# Altium project imx8m-devmodule.PrjPcb
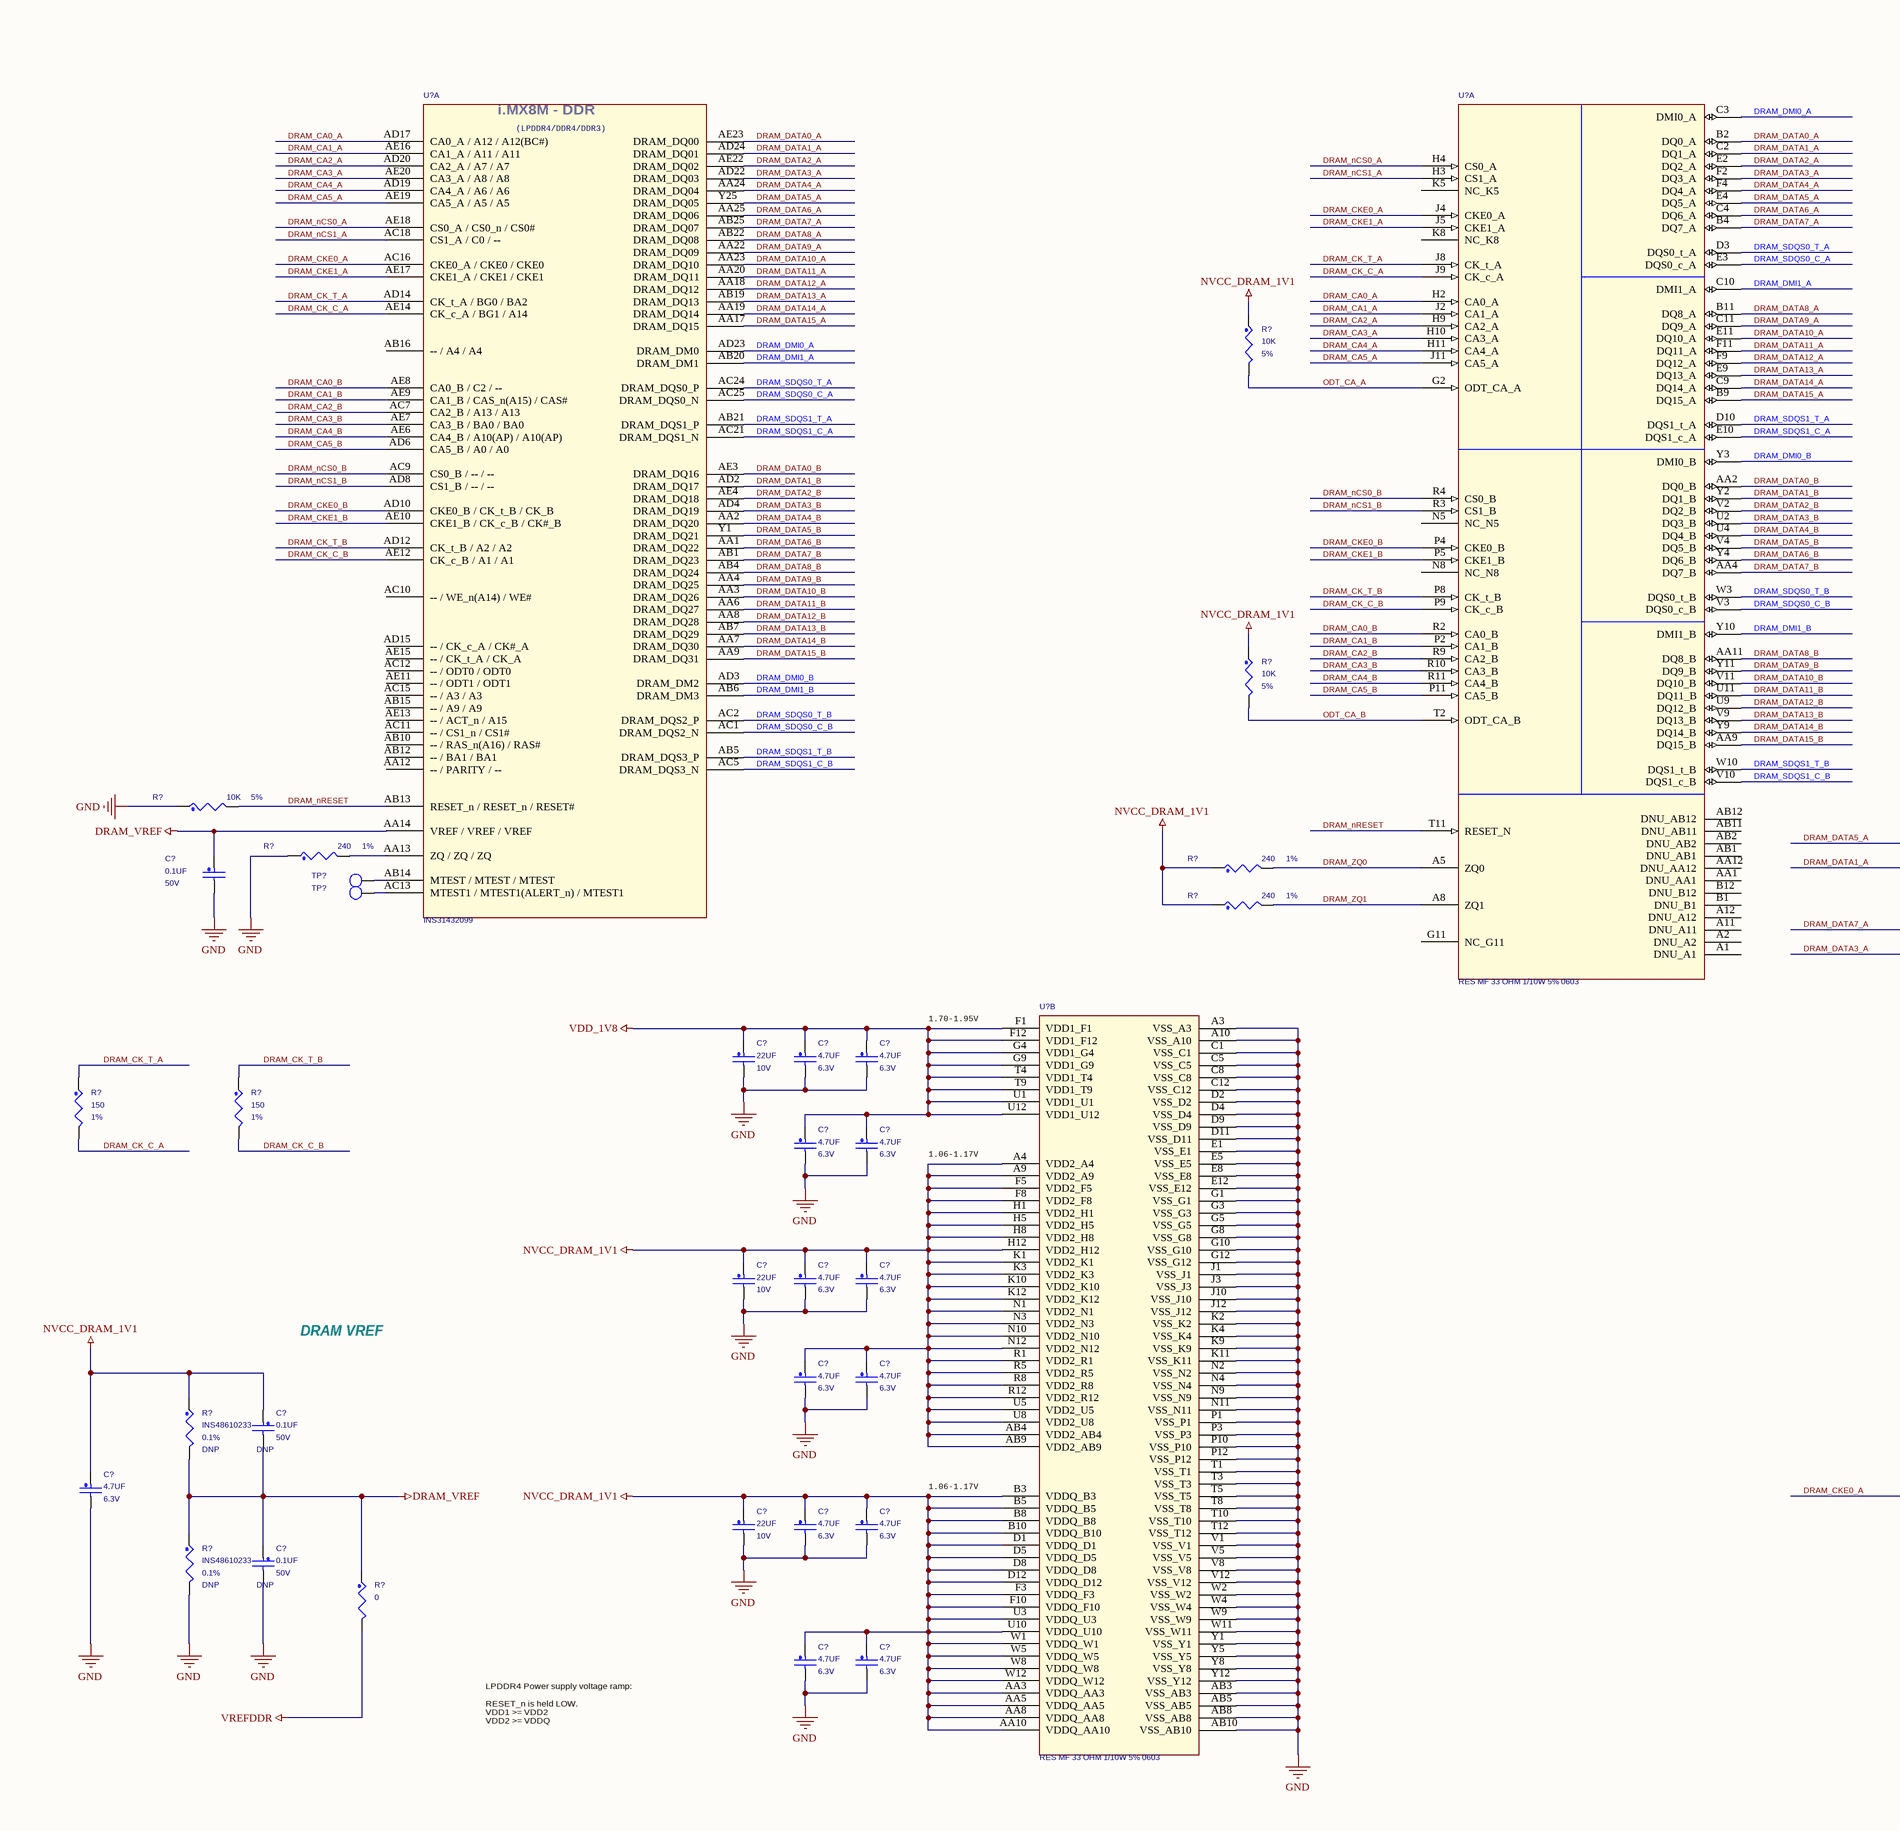
[diagram p0: C-05.1 DDR4 SO-DIMM 260.SchDoc, left]
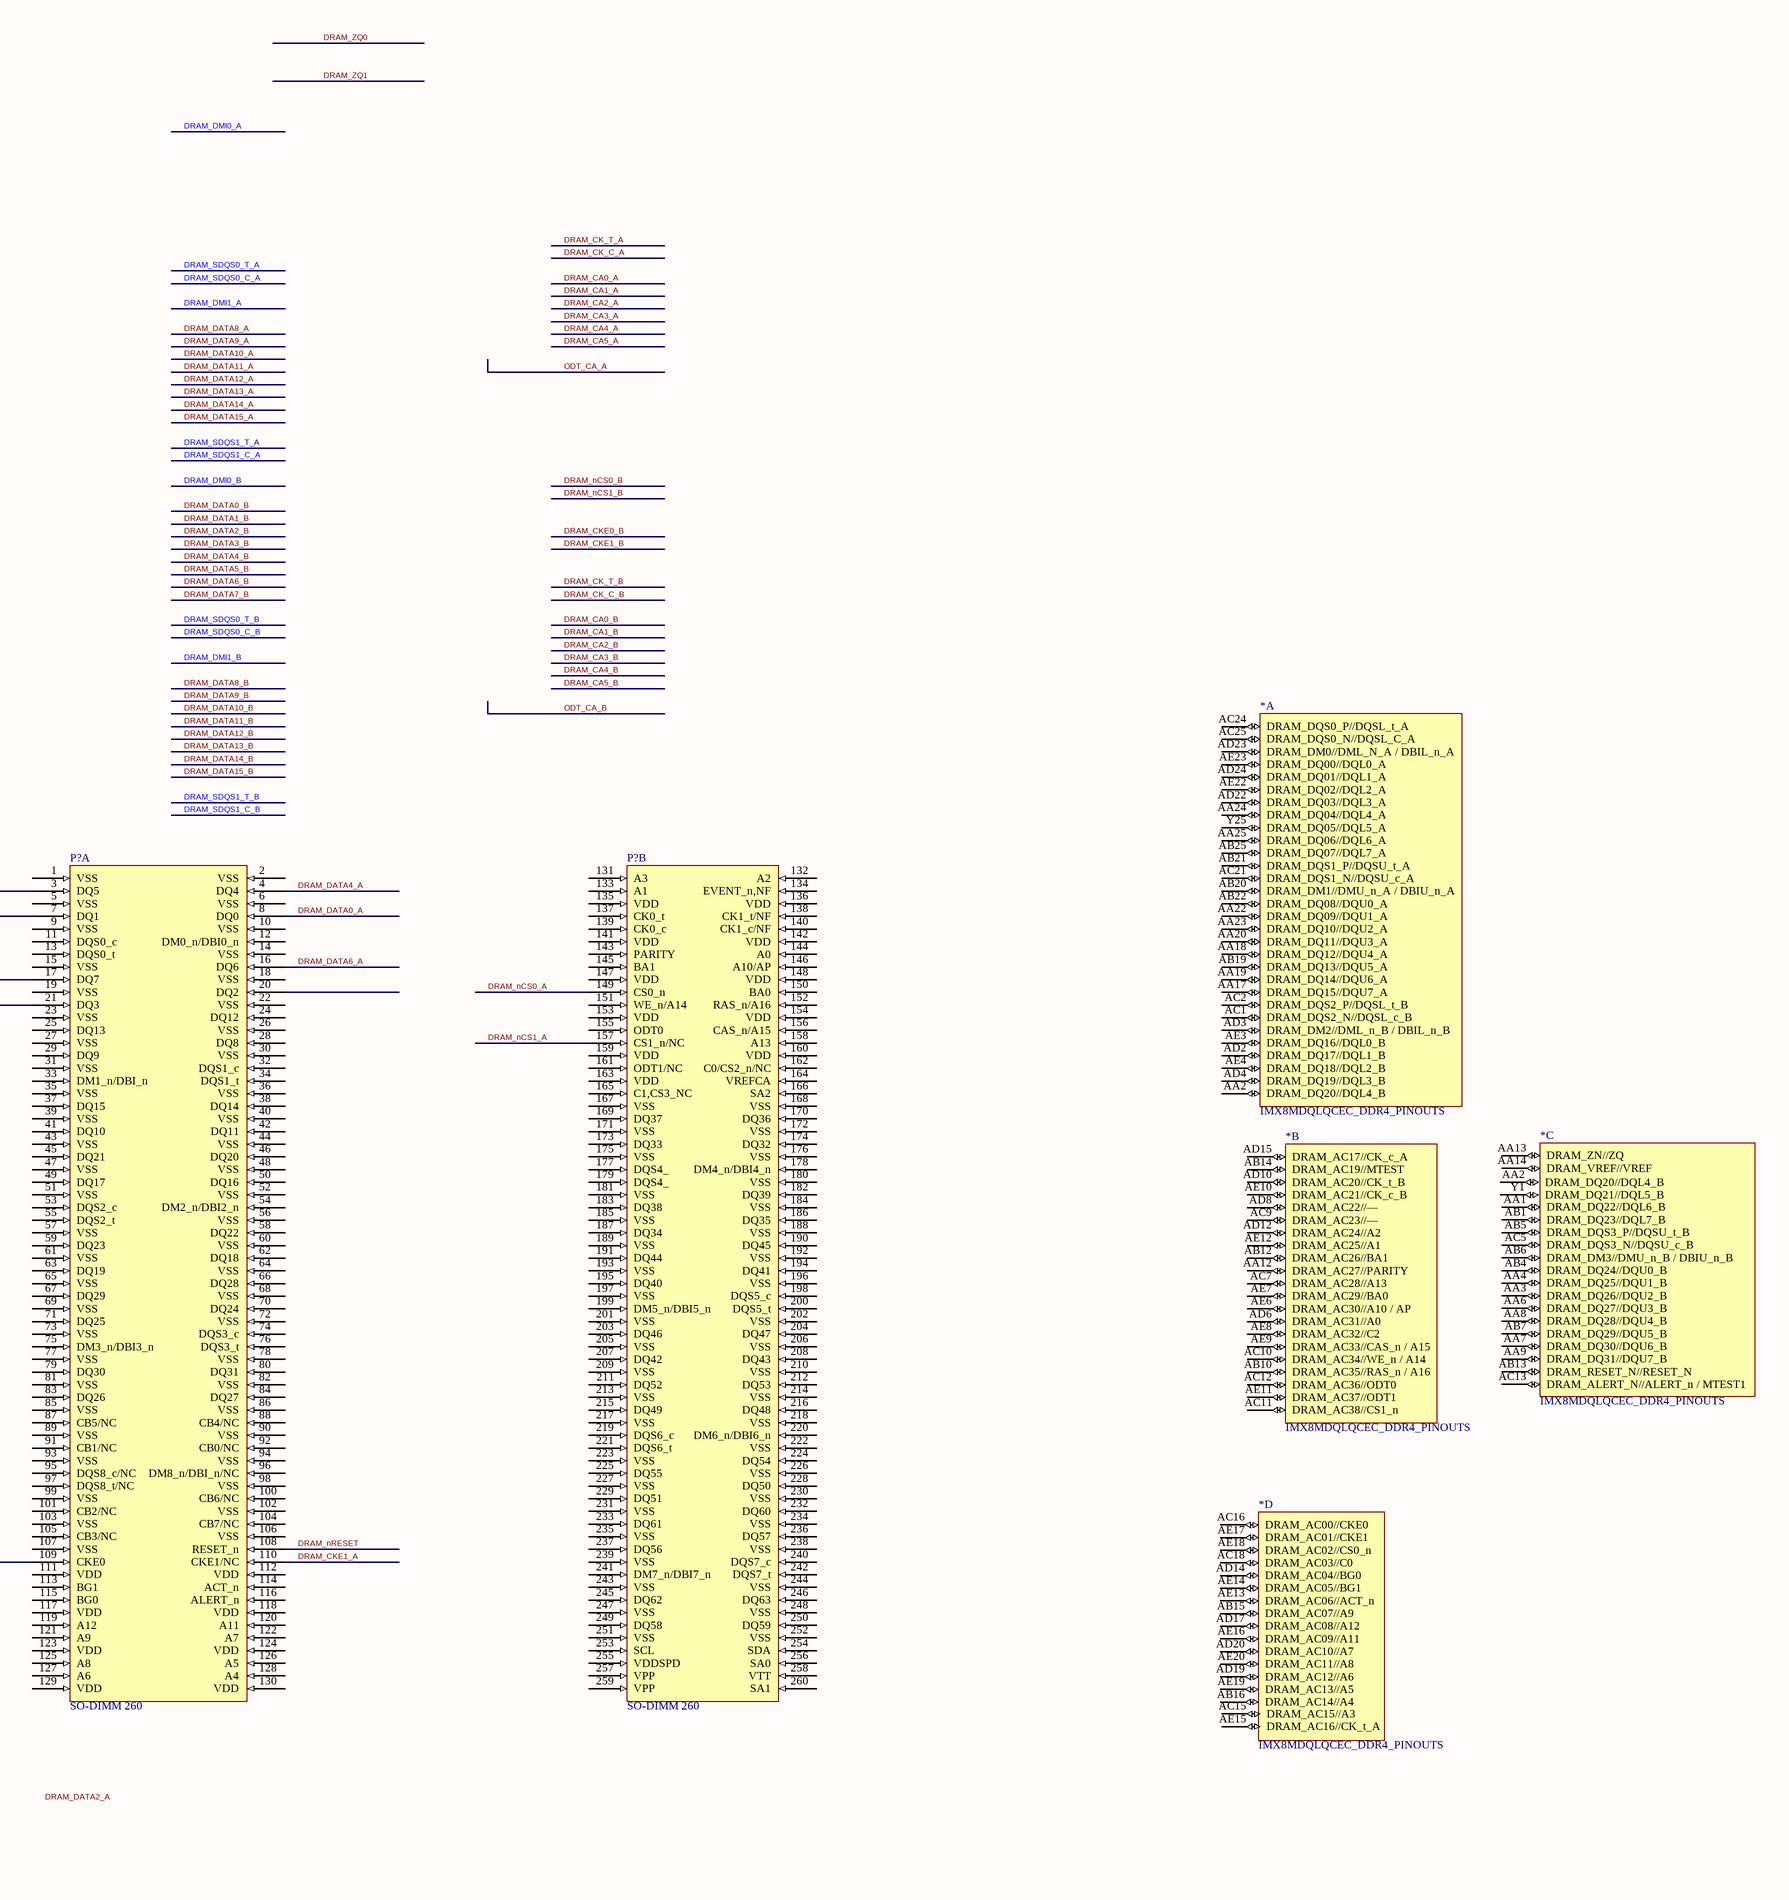
[diagram p1: C-05.1 DDR4 SO-DIMM 260.SchDoc, right]
2 sheets, 44 parts. Net scope: global (net labels, ports and power ports of the same name join across sheets).
Sheets:
  C-05.1 DDR4 SO-DIMM 260.SchDoc
  C-05 DDR3L.SchDoc

## Sheet C-05.1 DDR4 SO-DIMM 260.SchDoc
size A1

### Parts
(Parts that share a designator on the sheet are numbered #1, #2 ... from top to bottom, then left to right.)
*#1  IMX8MDQLQCEC_DDR4_PINOUTS  (part A of 4)
*#2  IMX8MDQLQCEC_DDR4_PINOUTS  (part B of 4)
*#3  IMX8MDQLQCEC_DDR4_PINOUTS  (part C of 4)
*#4  IMX8MDQLQCEC_DDR4_PINOUTS  (part D of 4)
C?#1  0.1UF  VOLTAGE: 50V  [0402_CC]
C?#2  22UF  VOLTAGE: 10V  [0603_CC]
C?#3  4.7UF  VOLTAGE: 6.3V  [0402_CC]
C?#4  4.7UF  VOLTAGE: 6.3V  [0402_CC]
C?#5  4.7UF  VOLTAGE: 6.3V  [0402_CC]
C?#6  4.7UF  VOLTAGE: 6.3V  [0402_CC]
C?#7  22UF  VOLTAGE: 10V  [0603_CC]
C?#8  4.7UF  VOLTAGE: 6.3V  [0402_CC]
C?#9  4.7UF  VOLTAGE: 6.3V  [0402_CC]
C?#10  4.7UF  VOLTAGE: 6.3V  [0402_CC]
C?#11  4.7UF  VOLTAGE: 6.3V  [0402_CC]
C?#12  0.1UF  ASSY_OPT: DNP  VOLTAGE: 50V  [0402_CC]
C?#13  4.7UF  VOLTAGE: 6.3V  [0402_CC]
C?#14  22UF  VOLTAGE: 10V  [0603_CC]
C?#15  4.7UF  VOLTAGE: 6.3V  [0402_CC]
C?#16  4.7UF  VOLTAGE: 6.3V  [0402_CC]
C?#17  0.1UF  ASSY_OPT: DNP  VOLTAGE: 50V  [0402_CC]
C?#18  4.7UF  VOLTAGE: 6.3V  [0402_CC]
C?#19  4.7UF  VOLTAGE: 6.3V  [0402_CC]
P?#1  SO-DIMM 260  [TE_2309413-1_2309413-1(Primary)]  (part A of 2)
P?#2  SO-DIMM 260  [TE_2309413-1_2309413-1(Primary)]  (part B of 2)
R?#1  10K  Tolerance: 5%  [0402_CC]
R?#2  10K  Tolerance: 5%  [0402_CC]
R?#3  10K  Tolerance: 5%  [0402_CC]
R?#4  240  Tolerance: 1%  [0402_CC]
R?#5  240  Tolerance: 1%  [0402_CC]
R?#6  240  Tolerance: 1%  [0402_CC]
R?#7  150  Tolerance: 1%  [0402_CC]
R?#8  150  Tolerance: 1%  [0402_CC]
R?#9  INS48610233  Tolerance: 0.1%  ASSY_OPT: DNP  [0603_CC]
R?#10  INS48610233  Tolerance: 0.1%  ASSY_OPT: DNP  [0603_CC]
R?#11  0  [0402_CC]
TP?#1  TP_35MIL  [testpoint_35mil]  (value not drawn)
TP?#2  TP_35MIL  [testpoint_35mil]  (value not drawn)
U?#1  INS31432099  [bga621_heatsink]  (part A of 14)
U?#2  RES MF 33 OHM 1/10W 5% 0603  [bga200_0p65x0p8_10p1x14p6]  (part A of 2)
U?#3  RES MF 33 OHM 1/10W 5% 0603  [bga200_0p65x0p8_10p1x14p6]  (part B of 2)

### Nets
DRAM_VREF: C?#1.1 C?#12.2 C?#17.1 R?#9.2 R?#10.1 R?#11.1 U?#1.AA14(VREF_/_VREF_/_VREF)
GND: C?#1.2 C?#2.2 C?#3.2 C?#4.2 C?#5.2 C?#6.2 C?#7.2 C?#8.2 C?#9.2 C?#10.2 C?#11.2 C?#13.2 C?#14.2 C?#15.2 C?#16.2 C?#17.2 C?#18.2 C?#19.2 R?#3.1 R?#4.1 R?#10.2 U?#3.A3(VSS_A3) U?#3.A10(VSS_A10) U?#3.AB3(VSS_AB3) U?#3.AB5(VSS_AB5) U?#3.AB8(VSS_AB8) U?#3.AB10(VSS_AB10) U?#3.C1(VSS_C1) U?#3.C5(VSS_C5) U?#3.C8(VSS_C8) U?#3.C12(VSS_C12) U?#3.D2(VSS_D2) U?#3.D4(VSS_D4) U?#3.D9(VSS_D9) U?#3.D11(VSS_D11) U?#3.E1(VSS_E1) U?#3.E5(VSS_E5) U?#3.E8(VSS_E8) U?#3.E12(VSS_E12) U?#3.G1(VSS_G1) U?#3.G3(VSS_G3) U?#3.G5(VSS_G5) U?#3.G8(VSS_G8) U?#3.G10(VSS_G10) U?#3.G12(VSS_G12) U?#3.J1(VSS_J1) U?#3.J3(VSS_J3) U?#3.J10(VSS_J10) U?#3.J12(VSS_J12) U?#3.K2(VSS_K2) U?#3.K4(VSS_K4) U?#3.K9(VSS_K9) U?#3.K11(VSS_K11) U?#3.N2(VSS_N2) U?#3.N4(VSS_N4) U?#3.N9(VSS_N9) U?#3.N11(VSS_N11) U?#3.P1(VSS_P1) U?#3.P3(VSS_P3) U?#3.P10(VSS_P10) U?#3.P12(VSS_P12) U?#3.T1(VSS_T1) U?#3.T3(VSS_T3) U?#3.T5(VSS_T5) U?#3.T8(VSS_T8) U?#3.T10(VSS_T10) U?#3.T12(VSS_T12) U?#3.V1(VSS_V1) U?#3.V5(VSS_V5) U?#3.V8(VSS_V8) U?#3.V12(VSS_V12) U?#3.W2(VSS_W2) U?#3.W4(VSS_W4) U?#3.W9(VSS_W9) U?#3.W11(VSS_W11) U?#3.Y1(VSS_Y1) U?#3.Y5(VSS_Y5) U?#3.Y8(VSS_Y8) U?#3.Y12(VSS_Y12)
NVCC_DRAM_1V1: C?#7.1 C?#8.1 C?#9.1 C?#10.1 C?#11.1 C?#12.1 C?#13.1 C?#14.1 C?#15.1 C?#16.1 C?#18.1 C?#19.1 R?#1.1 R?#2.1 R?#5.1 R?#6.1 R?#9.1 U?#3.A4(VDD2_A4) U?#3.A9(VDD2_A9) U?#3.AA3(VDDQ_AA3) U?#3.AA5(VDDQ_AA5) U?#3.AA8(VDDQ_AA8) U?#3.AA10(VDDQ_AA10) U?#3.AB4(VDD2_AB4) U?#3.AB9(VDD2_AB9) U?#3.B3(VDDQ_B3) U?#3.B5(VDDQ_B5) U?#3.B8(VDDQ_B8) U?#3.B10(VDDQ_B10) U?#3.D1(VDDQ_D1) U?#3.D5(VDDQ_D5) U?#3.D8(VDDQ_D8) U?#3.D12(VDDQ_D12) U?#3.F3(VDDQ_F3) U?#3.F5(VDD2_F5) U?#3.F8(VDD2_F8) U?#3.F10(VDDQ_F10) U?#3.H1(VDD2_H1) U?#3.H5(VDD2_H5) U?#3.H8(VDD2_H8) U?#3.H12(VDD2_H12) U?#3.K1(VDD2_K1) U?#3.K3(VDD2_K3) U?#3.K10(VDD2_K10) U?#3.K12(VDD2_K12) U?#3.N1(VDD2_N1) U?#3.N3(VDD2_N3) U?#3.N10(VDD2_N10) U?#3.N12(VDD2_N12) U?#3.R1(VDD2_R1) U?#3.R5(VDD2_R5) U?#3.R8(VDD2_R8) U?#3.R12(VDD2_R12) U?#3.U3(VDDQ_U3) U?#3.U5(VDD2_U5) U?#3.U8(VDD2_U8) U?#3.U10(VDDQ_U10) U?#3.W1(VDDQ_W1) U?#3.W5(VDDQ_W5) U?#3.W8(VDDQ_W8) U?#3.W12(VDDQ_W12)
VDD_1V8: C?#2.1 C?#3.1 C?#4.1 C?#5.1 C?#6.1 U?#3.F1(VDD1_F1) U?#3.F12(VDD1_F12) U?#3.G4(VDD1_G4) U?#3.G9(VDD1_G9) U?#3.T4(VDD1_T4) U?#3.T9(VDD1_T9) U?#3.U1(VDD1_U1) U?#3.U12(VDD1_U12)
VREFDDR: R?#11.2
DRAM_CA0_A: U?#1.AD17(CA0_A_/_A12_/_A12(BC#)) U?#2.H2(CA0_A)
DRAM_CA0_B: U?#1.AE8(CA0_B_/_C2_/_--) U?#2.R2(CA0_B)
DRAM_CA1_A: U?#1.AE16(CA1_A_/_A11_/_A11) U?#2.J2(CA1_A)
DRAM_CA1_B: U?#1.AE9(CA1_B_/_CAS_n(A15)_/_CAS#) U?#2.P2(CA1_B)
DRAM_CA2_A: U?#1.AD20(CA2_A_/_A7_/_A7) U?#2.H9(CA2_A)
DRAM_CA2_B: U?#1.AC7(CA2_B_/_A13_/_A13) U?#2.R9(CA2_B)
DRAM_CA3_A: U?#1.AE20(CA3_A_/_A8_/_A8) U?#2.H10(CA3_A)
DRAM_CA3_B: U?#1.AE7(CA3_B_/_BA0_/_BA0) U?#2.R10(CA3_B)
DRAM_CA4_A: U?#1.AD19(CA4_A_/_A6_/_A6) U?#2.H11(CA4_A)
DRAM_CA4_B: U?#1.AE6(CA4_B_/_A10(AP)_/_A10(AP)) U?#2.R11(CA4_B)
DRAM_CA5_A: U?#1.AE19(CA5_A_/_A5_/_A5) U?#2.J11(CA5_A)
DRAM_CA5_B: U?#1.AD6(CA5_B_/_A0_/_A0) U?#2.P11(CA5_B)
DRAM_CK_C_A: R?#7.2 U?#1.AE14(CK_c_A_/_BG1_/_A14) U?#2.J9(CK_c_A)
DRAM_CK_C_B: R?#8.2 U?#1.AE12(CK_c_B_/_A1_/_A1) U?#2.P9(CK_c_B)
DRAM_CK_T_A: R?#7.1 U?#1.AD14(CK_t_A_/_BG0_/_BA2) U?#2.J8(CK_t_A)
DRAM_CK_T_B: R?#8.1 U?#1.AD12(CK_t_B_/_A2_/_A2) U?#2.P8(CK_t_B)
DRAM_CKE0_A: P?#1.109(CKE0) U?#1.AC16(CKE0_A_/_CKE0_/_CKE0) U?#2.J4(CKE0_A)
DRAM_CKE0_B: U?#1.AD10(CKE0_B_/_CK_t_B_/_CK_B) U?#2.P4(CKE0_B)
DRAM_CKE1_A: P?#1.110(CKE1/NC) U?#1.AE17(CKE1_A_/_CKE1_/_CKE1) U?#2.J5(CKE1_A)
DRAM_CKE1_B: U?#1.AE10(CKE1_B_/_CK_c_B_/_CK#_B) U?#2.P5(CKE1_B)
DRAM_DATA0_A: P?#1.8(DQ0) U?#1.AE23(DRAM_DQ00) U?#2.B2(DQ0_A)
DRAM_DATA0_B: U?#1.AE3(DRAM_DQ16) U?#2.AA2(DQ0_B)
DRAM_DATA1_A: P?#1.7(DQ1) U?#1.AD24(DRAM_DQ01) U?#2.C2(DQ1_A)
DRAM_DATA1_B: U?#1.AD2(DRAM_DQ17) U?#2.Y2(DQ1_B)
DRAM_DATA2_A: U?#1.AE22(DRAM_DQ02) U?#2.E2(DQ2_A)
DRAM_DATA2_B: U?#1.AE4(DRAM_DQ18) U?#2.V2(DQ2_B)
DRAM_DATA3_A: P?#1.21(DQ3) U?#1.AD22(DRAM_DQ03) U?#2.F2(DQ3_A)
DRAM_DATA3_B: U?#1.AD4(DRAM_DQ19) U?#2.U2(DQ3_B)
DRAM_DATA4_A: P?#1.4(DQ4) U?#1.AA24(DRAM_DQ04) U?#2.F4(DQ4_A)
DRAM_DATA4_B: U?#1.AA2(DRAM_DQ20) U?#2.U4(DQ4_B)
DRAM_DATA5_A: P?#1.3(DQ5) U?#1.Y25(DRAM_DQ05) U?#2.E4(DQ5_A)
DRAM_DATA5_B: U?#1.Y1(DRAM_DQ21) U?#2.V4(DQ5_B)
DRAM_DATA6_A: P?#1.16(DQ6) U?#1.AA25(DRAM_DQ06) U?#2.C4(DQ6_A)
DRAM_DATA6_B: U?#1.AA1(DRAM_DQ22) U?#2.Y4(DQ6_B)
DRAM_DATA7_A: P?#1.17(DQ7) U?#1.AB25(DRAM_DQ07) U?#2.B4(DQ7_A)
DRAM_DATA7_B: U?#1.AB1(DRAM_DQ23) U?#2.AA4(DQ7_B)
DRAM_DATA8_A: U?#1.AB22(DRAM_DQ08) U?#2.B11(DQ8_A)
DRAM_DATA8_B: U?#1.AB4(DRAM_DQ24) U?#2.AA11(DQ8_B)
DRAM_DATA9_A: U?#1.AA22(DRAM_DQ09) U?#2.C11(DQ9_A)
DRAM_DATA9_B: U?#1.AA4(DRAM_DQ25) U?#2.Y11(DQ9_B)
DRAM_DATA10_A: U?#1.AA23(DRAM_DQ10) U?#2.E11(DQ10_A)
DRAM_DATA10_B: U?#1.AA3(DRAM_DQ26) U?#2.V11(DQ10_B)
DRAM_DATA11_A: U?#1.AA20(DRAM_DQ11) U?#2.F11(DQ11_A)
DRAM_DATA11_B: U?#1.AA6(DRAM_DQ27) U?#2.U11(DQ11_B)
DRAM_DATA12_A: U?#1.AA18(DRAM_DQ12) U?#2.F9(DQ12_A)
DRAM_DATA12_B: U?#1.AA8(DRAM_DQ28) U?#2.U9(DQ12_B)
DRAM_DATA13_A: U?#1.AB19(DRAM_DQ13) U?#2.E9(DQ13_A)
DRAM_DATA13_B: U?#1.AB7(DRAM_DQ29) U?#2.V9(DQ13_B)
DRAM_DATA14_A: U?#1.AA19(DRAM_DQ14) U?#2.C9(DQ14_A)
DRAM_DATA14_B: U?#1.AA7(DRAM_DQ30) U?#2.Y9(DQ14_B)
DRAM_DATA15_A: U?#1.AA17(DRAM_DQ15) U?#2.B9(DQ15_A)
DRAM_DATA15_B: U?#1.AA9(DRAM_DQ31) U?#2.AA9(DQ15_B)
DRAM_DMI0_A: U?#1.AD23(DRAM_DM0) U?#2.C3(DMI0_A)
DRAM_DMI0_B: U?#1.AD3(DRAM_DM2) U?#2.Y3(DMI0_B)
DRAM_DMI1_A: U?#1.AB20(DRAM_DM1) U?#2.C10(DMI1_A)
DRAM_DMI1_B: U?#1.AB6(DRAM_DM3) U?#2.Y10(DMI1_B)
DRAM_nCS0_A: P?#2.149(CS0_n) U?#1.AE18(CS0_A_/_CS0_n_/_CS0#) U?#2.H4(CS0_A)
DRAM_nCS0_B: U?#1.AC9(CS0_B_/_--_/_--) U?#2.R4(CS0_B)
DRAM_nCS1_A: P?#2.157(CS1_n/NC) U?#1.AC18(CS1_A_/_C0_/_--) U?#2.H3(CS1_A)
DRAM_nCS1_B: U?#1.AD8(CS1_B_/_--_/_--) U?#2.R3(CS1_B)
DRAM_nRESET: P?#1.108(RESET_n) R?#3.2 U?#1.AB13(RESET_n_/_RESET_n_/_RESET#) U?#2.T11(RESET_N)
DRAM_SDQS0_C_A: U?#1.AC25(DRAM_DQS0_N) U?#2.E3(DQS0_c_A)
DRAM_SDQS0_C_B: U?#1.AC1(DRAM_DQS2_N) U?#2.V3(DQS0_c_B)
DRAM_SDQS0_T_A: U?#1.AC24(DRAM_DQS0_P) U?#2.D3(DQS0_t_A)
DRAM_SDQS0_T_B: U?#1.AC2(DRAM_DQS2_P) U?#2.W3(DQS0_t_B)
DRAM_SDQS1_C_A: U?#1.AC21(DRAM_DQS1_N) U?#2.E10(DQS1_c_A)
DRAM_SDQS1_C_B: U?#1.AC5(DRAM_DQS3_N) U?#2.V10(DQS1_c_B)
DRAM_SDQS1_T_A: U?#1.AB21(DRAM_DQS1_P) U?#2.D10(DQS1_t_A)
DRAM_SDQS1_T_B: U?#1.AB5(DRAM_DQS3_P) U?#2.W10(DQS1_t_B)
DRAM_ZQ0: R?#5.2 U?#2.A5(ZQ0)
DRAM_ZQ1: R?#6.2 U?#2.A8(ZQ1)
ODT_CA_A: R?#1.2 U?#2.G2(ODT_CA_A)
ODT_CA_B: R?#2.2 U?#2.T2(ODT_CA_B)
NetR?#4_2: R?#4.2 U?#1.AA13(ZQ_/_ZQ_/_ZQ)
NetTP?#1_1: TP?#1.1(TP) U?#1.AB14(MTEST_/_MTEST_/_MTEST)
NetTP?#2_1: TP?#2.1(TP) U?#1.AC13(MTEST1_/_MTEST1(ALERT_n)_/_MTEST1)

Not connected (* = marked no-connect by the designer): *#1 AA2(DRAM_DQ20//DQL4_B) AA17(DRAM_DQ15//DQU7_A) AA18(DRAM_DQ12//DQU4_A) AA19(DRAM_DQ14//DQU6_A) AA20(DRAM_DQ11//DQU3_A) AA22(DRAM_DQ09//DQU1_A) AA23(DRAM_DQ10//DQU2_A) AA24(DRAM_DQ04//DQL4_A) AA25(DRAM_DQ06//DQL6_A) AB19(DRAM_DQ13//DQU5_A) AB20(DRAM_DM1//DMU_n_A_/_DBIU_n_A) AB21(DRAM_DQS1_P//DQSU_t_A) AB22(DRAM_DQ08//DQU0_A) AB25(DRAM_DQ07//DQL7_A) AC1(DRAM_DQS2_N//DQSL_c_B) AC2(DRAM_DQS2_P//DQSL_t_B) AC21(DRAM_DQS1_N//DQSU_c_A) AC24(DRAM_DQS0_P//DQSL_t_A) AC25(DRAM_DQS0_N//DQSL_C_A) AD2(DRAM_DQ17//DQL1_B) AD3(DRAM_DM2//DML_n_B_/_DBIL_n_B) AD4(DRAM_DQ19//DQL3_B) AD22(DRAM_DQ03//DQL3_A) AD23(DRAM_DM0//DML_N_A_/_DBIL_n_A) AD24(DRAM_DQ01//DQL1_A) AE3(DRAM_DQ16//DQL0_B) AE4(DRAM_DQ18//DQL2_B) AE22(DRAM_DQ02//DQL2_A) AE23(DRAM_DQ00//DQL0_A) Y25(DRAM_DQ05//DQL5_A); *#2 AA12(DRAM_AC27//PARITY) AB10(DRAM_AC35//RAS_n_/_A16) AB12(DRAM_AC26//BA1) AB14(DRAM_AC19//MTEST) AC7(DRAM_AC28//A13) AC9(DRAM_AC23//—) AC10(DRAM_AC34//WE_n_/_A14) AC11(DRAM_AC38//CS1_n) AC12(DRAM_AC36//ODT0) AD6(DRAM_AC31//A0) AD8(DRAM_AC22//—) AD10(DRAM_AC20//CK_t_B) AD12(DRAM_AC24//A2) AD15(DRAM_AC17//CK_c_A) AE6(DRAM_AC30//A10_/_AP) AE7(DRAM_AC29//BA0) AE8(DRAM_AC32//C2) AE9(DRAM_AC33//CAS_n_/_A15) AE10(DRAM_AC21//CK_c_B) AE11(DRAM_AC37//ODT1) AE12(DRAM_AC25//A1); *#3 AA1(DRAM_DQ22//DQL6_B) AA2(DRAM_DQ20//DQL4_B) AA3(DRAM_DQ26//DQU2_B) AA4(DRAM_DQ25//DQU1_B) AA6(DRAM_DQ27//DQU3_B) AA7(DRAM_DQ30//DQU6_B) AA8(DRAM_DQ28//DQU4_B) AA9(DRAM_DQ31//DQU7_B) AA13(DRAM_ZN//ZQ) AA14(DRAM_VREF//VREF) AB1(DRAM_DQ23//DQL7_B) AB4(DRAM_DQ24//DQU0_B) AB5(DRAM_DQS3_P//DQSU_t_B) AB6(DRAM_DM3//DMU_n_B_/_DBIU_n_B) AB7(DRAM_DQ29//DQU5_B) AB13(DRAM_RESET_N//RESET_N) AC5(DRAM_DQS3_N//DQSU_c_B) AC13(DRAM_ALERT_N//ALERT_n_/_MTEST1) Y1(DRAM_DQ21//DQL5_B); *#4 AB15(DRAM_AC07//A9) AB16(DRAM_AC14//A4) AC15(DRAM_AC15//A3) AC16(DRAM_AC00//CKE0) AC18(DRAM_AC03//C0) AD14(DRAM_AC04//BG0) AD17(DRAM_AC08//A12) AD19(DRAM_AC12//A6) AD20(DRAM_AC10//A7) AE13(DRAM_AC06//ACT_n) AE14(DRAM_AC05//BG1) AE15(DRAM_AC16//CK_t_A) AE16(DRAM_AC09//A11) AE17(DRAM_AC01//CKE1) AE18(DRAM_AC02//CS0_n) AE19(DRAM_AC13//A5) AE20(DRAM_AC11//A8); P?#1 1(VSS) 2(VSS) 5(VSS) 6(VSS) 9(VSS) 10(VSS) 11(DQS0_c) 12(DM0_n/DBI0_n) 13(DQS0_t) 14(VSS) 15(VSS) 18(VSS) 19(VSS) 20(DQ2) 22(VSS) 23(VSS) 24(DQ12) 25(DQ13) 26(VSS) 27(VSS) 28(DQ8) 29(DQ9) 30(VSS) 31(VSS) 32(DQS1_c) 33(DM1_n/DBI_n) 34(DQS1_t) 35(VSS) 36(VSS) 37(DQ15) 38(DQ14) 39(VSS) 40(VSS) 41(DQ10) 42(DQ11) 43(VSS) 44(VSS) 45(DQ21) 46(DQ20) 47(VSS) 48(VSS) 49(DQ17) 50(DQ16) 51(VSS) 52(VSS) 53(DQS2_c) 54(DM2_n/DBI2_n) 55(DQS2_t) 56(VSS) 57(VSS) 58(DQ22) 59(DQ23) 60(VSS) 61(VSS) 62(DQ18) 63(DQ19) 64(VSS) 65(VSS) 66(DQ28) 67(DQ29) 68(VSS) 69(VSS) 70(DQ24) 71(DQ25) 72(VSS) 73(VSS) 74(DQS3_c) 75(DM3_n/DBI3_n) 76(DQS3_t) 77(VSS) 78(VSS) 79(DQ30) 80(DQ31) 81(VSS) 82(VSS) 83(DQ26) 84(DQ27) 85(VSS) 86(VSS) 87(CB5/NC) 88(CB4/NC) 89(VSS) 90(VSS) 91(CB1/NC) 92(CB0/NC) 93(VSS) 94(VSS) 95(DQS8_c/NC) 96(DM8_n/DBI_n/NC) 97(DQS8_t/NC) 98(VSS) 99(VSS) 100(CB6/NC) 101(CB2/NC) 102(VSS) 103(VSS) 104(CB7/NC) 105(CB3/NC) 106(VSS) 107(VSS) 111(VDD) 112(VDD) 113(BG1) 114(ACT_n) 115(BG0) 116(ALERT_n) 117(VDD) 118(VDD) 119(A12) 120(A11) 121(A9) 122(A7) 123(VDD) 124(VDD) 125(A8) 126(A5) 127(A6) 128(A4) 129(VDD) 130(VDD); P?#2 131(A3) 132(A2) 133(A1) 134(EVENT_n,NF) 135(VDD) 136(VDD) 137(CK0_t) 138(CK1_t/NF) 139(CK0_c) 140(CK1_c/NF) 141(VDD) 142(VDD) 143(PARITY) 144(A0) 145(BA1) 146(A10/AP) 147(VDD) 148(VDD) 150(BA0) 151(WE_n/A14) 152(RAS_n/A16) 153(VDD) 154(VDD) 155(ODT0) 156(CAS_n/A15) 158(A13) 159(VDD) 160(VDD) 161(ODT1/NC) 162(C0/CS2_n/NC) 163(VDD) 164(VREFCA) 165(C1,CS3_NC) 166(SA2) 167(VSS) 168(VSS) 169(DQ37) 170(DQ36) 171(VSS) 172(VSS) 173(DQ33) 174(DQ32) 175(VSS) 176(VSS) 177(DQS4_) 178(DM4_n/DBI4_n) 179(DQS4_) 180(VSS) 181(VSS) 182(DQ39) 183(DQ38) 184(VSS) 185(VSS) 186(DQ35) 187(DQ34) 188(VSS) 189(VSS) 190(DQ45) 191(DQ44) 192(VSS) 193(VSS) 194(DQ41) 195(DQ40) 196(VSS) 197(VSS) 198(DQS5_c) 199(DM5_n/DBI5_n) 200(DQS5_t) 201(VSS) 202(VSS) 203(DQ46) 204(DQ47) 205(VSS) 206(VSS) 207(DQ42) 208(DQ43) 209(VSS) 210(VSS) 211(DQ52) 212(DQ53) 213(VSS) 214(VSS) 215(DQ49) 216(DQ48) 217(VSS) 218(VSS) 219(DQS6_c) 220(DM6_n/DBI6_n) 221(DQS6_t) 222(VSS) 223(VSS) 224(DQ54) 225(DQ55) 226(VSS) 227(VSS) 228(DQ50) 229(DQ51) 230(VSS) 231(VSS) 232(DQ60) 233(DQ61) 234(VSS) 235(VSS) 236(DQ57) 237(DQ56) 238(VSS) 239(VSS) 240(DQS7_c) 241(DM7_n/DBI7_n) 242(DQS7_t) 243(VSS) 244(VSS) 245(DQ62) 246(DQ63) 247(VSS) 248(VSS) 249(DQ58) 250(DQ59) 251(VSS) 252(VSS) 253(SCL) 254(SDA) 255(VDDSPD) 256(SA0) 257(VPP) 258(VTT) 259(VPP) 260(SA1); U?#1 AA12(--_/_PARITY_/_--) AB10(--_/_RAS_n(A16)_/_RAS#) AB12(--_/_BA1_/_BA1) AB15(--_/_A9_/_A9) AB16(--_/_A4_/_A4) AC10(--_/_WE_n(A14)_/_WE#) AC11(--_/_CS1_n_/_CS1#) AC12(--_/_ODT0_/_ODT0) AC15(--_/_A3_/_A3) AD15(--_/_CK_c_A_/_CK#_A) AE11(--_/_ODT1_/_ODT1) AE13(--_/_ACT_n_/_A15) AE15(--_/_CK_t_A_/_CK_A); U?#2 A1(DNU_A1) A2(DNU_A2) A11(DNU_A11) A12(DNU_A12) AA1(DNU_AA1) AA12(DNU_AA12) AB1(DNU_AB1) AB2(DNU_AB2) AB11(DNU_AB11) AB12(DNU_AB12) B1(DNU_B1) B12(DNU_B12) G11(NC_G11) K5(NC_K5) K8(NC_K8) N5(NC_N5) N8(NC_N8)

### Notes on the sheet
- 1.70-1.95V
- 1.06-1.17V
- DRAM VREF
- LPDDR4 Power supply voltage ramp:
  RESET_n is held LOW.
  VDD1 >= VDD2
  VDD2 >= VDDQ
- Labels drawn without touching a wire or pin: DRAM_DATA2_A
- (in symbol MIMX8MQ7DVAJZXA_BGA621, part A) i.MX8M - DDR; (LPDDR4/DDR4/DDR3)

### Library data of the parts
C?#1 C?#12 C?#17 = CAP_NP: CAP CER 0.1uF 50V 10% X7R 0402; CLASS: DISCRETE; AGILE_PN: 150-79069; MFG_NAME01: MURATA; MFG_PN01: GRM155R71H104KE14D; CAD_APPROVED: Yes; FPLIST: CC0402_25,CC0402_HD,0402_CC; Tolerance: 10%; ROHS: Yes; HEIGHT: 0.55MM
C?#2 C?#7 C?#14 = CAP_NP: CAP CER 22uF 10V 20% X5R 0603; CLASS: DISCRETE; AGILE_PN: 150-79530; MFG_NAME01: TDK; MFG_PN01: C1608X5R1A226M080AC; CAD_APPROVED: Yes; FPLIST: CC0603_OV,CC0603,0603_CC; Tolerance: 20%; ROHS: Yes; HEIGHT: 1MM
C?#3-C?#6 C?#8-C?#11 C?#15 C?#16 C?#18 C?#19 = CAP_NP: CAP CER 4.7UF 6.3V 20% X5R 0402; CLASS: DISCRETE; AGILE_PN: 150-78463; MFG_NAME01: TDK; MFG_PN01: C1005X5R0J475M050BC; CAD_APPROVED: Yes; FPLIST: CC0402_25,CC0402_HD,0402_CC; Tolerance: 20%; ROHS: Yes; HEIGHT: 0.65MM
C?#13 = CAP_NP: CAP CER 4.7UF 6.3V 20% X5R 0402; CLASS: DISCRETE; FPLIST: CC0402_25,CC0402_HD,0402_CC; CAD_APPROVED: Yes; MFG_PN01: C1005X5R0J475M050BC; MFG_NAME01: TDK; AGILE_PN: 150-78463; HEIGHT: 0.65MM; ROHS: Yes; Tolerance: 20%
P?#1 P?#2 = DDR4_SO-DIMM_CONNECTOR
R?#1-R?#3 = RES: RES MF 10K 1/16W 5% 0402; CLASS: DISCRETE; FPLIST: RC0402_25,RC0402_HD,0402_CC; CAD_APPROVED: Yes; MFG_PN01: CRCW040210K0JNED; MFG_NAME01: VISHAY INTERTECHNOLOGY; AGILE_PN: 470-75557; HEIGHT: 0.4 MM; ROHS: Yes
  R?#3: TOL: 5%
R?#4 = RES: RES MF 240 OHM 1/16W 1% 0402; CLASS: DISCRETE; FPLIST: RC0402_25,RC0402_HD,0402_CC; CAD_APPROVED: Yes; MFG_PN01: WR04X2400FTL; MFG_NAME01: WALSIN TECHNOLOGY CORP.; AGILE_PN: 470-30776; ROHS: Yes; HEIGHT: 0.40 MM
R?#5 R?#6 = RES: RES MF 240 OHM 1/16W 1% 0402; CLASS: DISCRETE; AGILE_PN: 470-30776; MFG_NAME01: WALSIN TECHNOLOGY CORP.; MFG_PN01: WR04X2400FTL; CAD_APPROVED: Yes; FPLIST: RC0402_25,RC0402_HD,0402_CC; ROHS: Yes; HEIGHT: 0.40 MM
R?#7 R?#8 = RES: RES MF 150 OHM 1/16W 1% 0402; CLASS: DISCRETE; AGILE_PN: 470-75353; MFG_NAME01: BOURNS; MFG_PN01: CR0402-FX-1500GLF; CAD_APPROVED: Yes; FPLIST: RC0402_25,RC0402_HD,0402_CC; ROHS: Yes; HEIGHT: 0.4MM
R?#9 R?#10 = RES: RES MF 1.5K 1/10W 0.1% 0603; CLASS: DISCRETE; AGILE_PN: 470-80435; MFG_NAME01: Panasonic; MFG_PN01: ERA3AEB152V; CAD_APPROVED: Yes; FPLIST: RC0603_OV,RC0603,0603_CC; ROHS: Yes; HEIGHT: 0.55MM
R?#11 = RES: RES MF ZERO OHM 1/16W 5% 0402; CLASS: DISCRETE; AGILE_PN: 470-75394; MFG_NAME01: ROHM; MFG_PN01: MCR01MZPJ000; CAD_APPROVED: Yes; FPLIST: RC0402_25,RC0402_HD,RC0402_X2,0402_CC; Tolerance: 5%; ROHS: Yes; HEIGHT: 0.45 MM
TP?#1 = T POINT R: TEST POINT PAD .035 SMT, no part to order; CLASS: IC; AGILE_PN: 510-75618; CAD_APPROVED: Yes; ROHS: Yes; HEIGHT: 0.1MM
TP?#2 = T POINT R: TEST POINT PAD .035 SMT, no part to order; CLASS: IC; CAD_APPROVED: Yes; AGILE_PN: 510-75618; HEIGHT: 0.1MM; ROHS: Yes
U?#1 = MIMX8MQ7DVAJZXA_BGA621: SUBASSEMBLY, IC CPU QUAD CORTEX A53+M4 1.5GHZ BGA621 + HEAT SINK, PUSH PIN BLACK ALUMINUM 14MM; SPLIT_INST: TRUE; SWAP_INFO: (S1+S2+S3+S4+S5+S6+S7+S8+S9+S10+S11+S12+S13); CAD_APPROVED: Yes; MFG_PN01: 330-77109,901-76977; MFG_NAME01: NXP SEMICONDUCTORS; AGILE_PN: 750-78064; CLASS: IC; HEIGHT: 16.78 MM; ROHS: Yes
U?#2 U?#3 = MT53B768M32D4NQ_200P: IC MEM MOBILE LPDDR4 SDRAM 768 Meg x 32 4CH X16 I/O 1.1V AUTO VFBGA200; SWAP_INFO: (S1+S2); SPLIT_INST: TRUE; CAD_APPROVED: Yes; Temp_Range: -30&#8451; to 85&#8451;; MFG_PN01: MT53B768M32D4NQ-062 WT:B; MFG_NAME01: MICRON; AGILE_PN: 334-77729; CLASS: IC; HEIGHT: 0.95MM; ROHS: Yes

## Sheet C-05 DDR3L.SchDoc
size A3
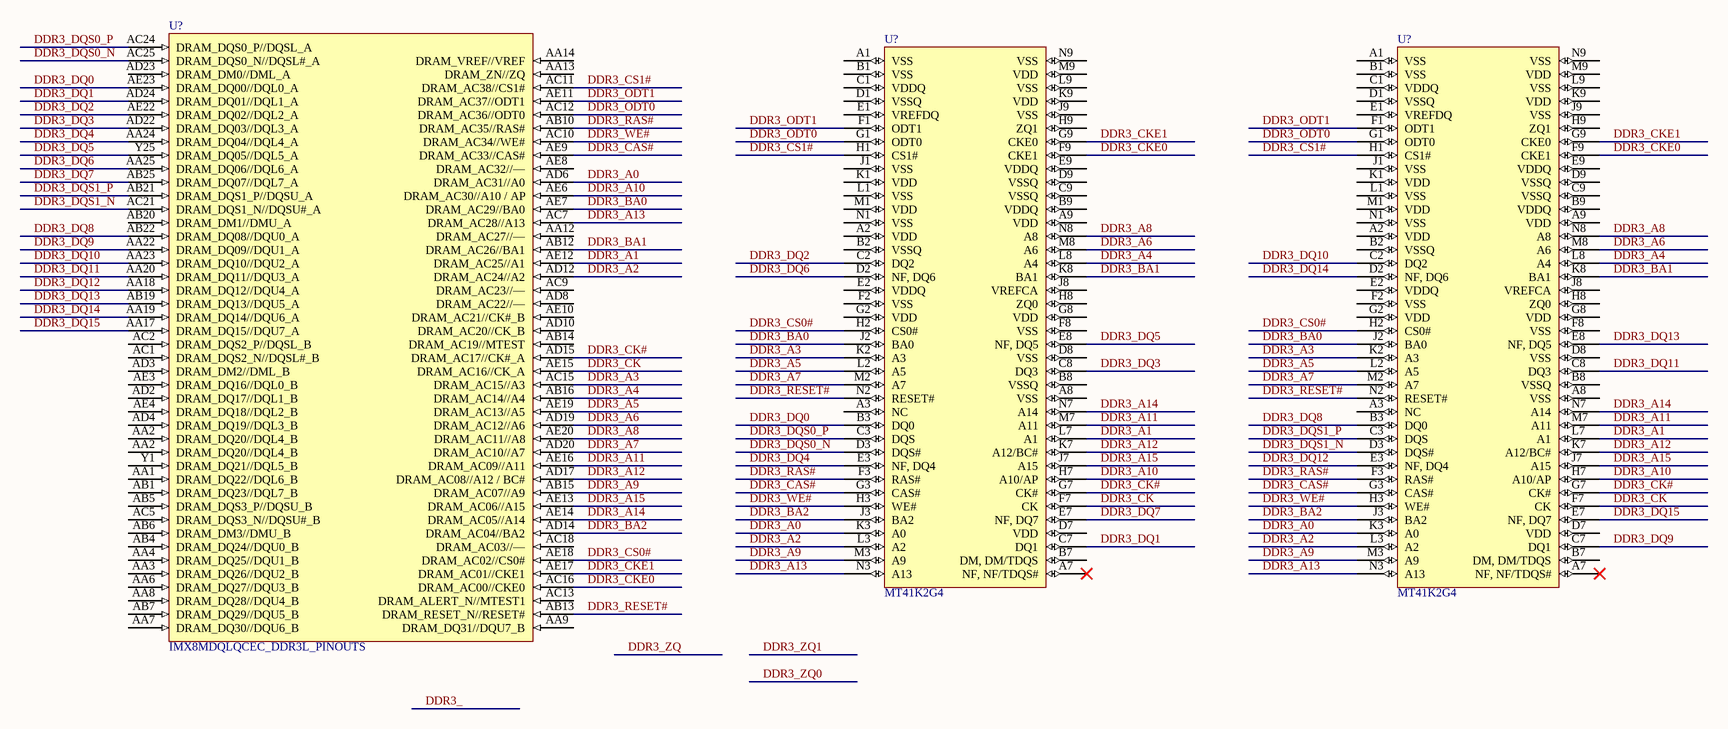
[diagram p2: C-05 DDR3L.SchDoc]

### Parts
(Parts that share a designator on the sheet are numbered #1, #2 ... from top to bottom, then left to right.)
U?#4  IMX8MDQLQCEC_DDR3L_PINOUTS
U?#5  MT41K2G4
U?#6  MT41K2G4

### Nets
DDR3_A0: U?#4.AD6(DRAM_AC31//A0) U?#5.K3(A0) U?#6.K3(A0)
DDR3_A1: U?#4.AE12(DRAM_AC25//A1) U?#5.L7(A1) U?#6.L7(A1)
DDR3_A2: U?#4.AD12(DRAM_AC24//A2) U?#5.L3(A2) U?#6.L3(A2)
DDR3_A3: U?#4.AC15(DRAM_AC15//A3) U?#5.K2(A3) U?#6.K2(A3)
DDR3_A4: U?#4.AB16(DRAM_AC14//A4) U?#5.L8(A4) U?#6.L8(A4)
DDR3_A5: U?#4.AE19(DRAM_AC13//A5) U?#5.L2(A5) U?#6.L2(A5)
DDR3_A6: U?#4.AD19(DRAM_AC12//A6) U?#5.M8(A6) U?#6.M8(A6)
DDR3_A7: U?#4.AD20(DRAM_AC10//A7) U?#5.M2(A7) U?#6.M2(A7)
DDR3_A8: U?#4.AE20(DRAM_AC11//A8) U?#5.N8(A8) U?#6.N8(A8)
DDR3_A9: U?#4.AB15(DRAM_AC07//A9) U?#5.M3(A9) U?#6.M3(A9)
DDR3_A10: U?#4.AE6(DRAM_AC30//A10_/_AP) U?#5.H7(A10/AP) U?#6.H7(A10/AP)
DDR3_A11: U?#4.AE16(DRAM_AC09//A11) U?#5.M7(A11) U?#6.M7(A11)
DDR3_A12: U?#4.AD17(DRAM_AC08//A12_/_BC#) U?#5.K7(A12/BC#) U?#6.K7(A12/BC#)
DDR3_A13: U?#4.AC7(DRAM_AC28//A13) U?#5.N3(A13) U?#6.N3(A13)
DDR3_A14: U?#4.AE14(DRAM_AC05//A14) U?#5.N7(A14) U?#6.N7(A14)
DDR3_A15: U?#4.AE13(DRAM_AC06//A15) U?#5.J7(A15) U?#6.J7(A15)
DDR3_BA0: U?#4.AE7(DRAM_AC29//BA0) U?#5.J2(BA0) U?#6.J2(BA0)
DDR3_BA1: U?#4.AB12(DRAM_AC26//BA1) U?#5.K8(BA1) U?#6.K8(BA1)
DDR3_BA2: U?#4.AD14(DRAM_AC04//BA2) U?#5.J3(BA2) U?#6.J3(BA2)
DDR3_CAS#: U?#4.AE9(DRAM_AC33//CAS#) U?#5.G3(CAS#) U?#6.G3(CAS#)
DDR3_CK: U?#4.AE15(DRAM_AC16//CK_A) U?#5.F7(CK) U?#6.F7(CK)
DDR3_CK#: U?#4.AD15(DRAM_AC17//CK#_A) U?#5.G7(CK#) U?#6.G7(CK#)
DDR3_CKE0: U?#4.AC16(DRAM_AC00//CKE0) U?#5.F9(CKE1) U?#6.F9(CKE1)
DDR3_CKE1: U?#4.AE17(DRAM_AC01//CKE1) U?#5.G9(CKE0) U?#6.G9(CKE0)
DDR3_CS0#: U?#4.AE18(DRAM_AC02//CS0#) U?#5.H2(CS0#) U?#6.H2(CS0#)
DDR3_CS1#: U?#4.AC11(DRAM_AC38//CS1#) U?#5.H1(CS1#) U?#6.H1(CS1#)
DDR3_DQ0: U?#4.AE23(DRAM_DQ00//DQL0_A) U?#5.B3(DQ0)
DDR3_DQ1: U?#4.AD24(DRAM_DQ01//DQL1_A) U?#5.C7(DQ1)
DDR3_DQ2: U?#4.AE22(DRAM_DQ02//DQL2_A) U?#5.C2(DQ2)
DDR3_DQ3: U?#4.AD22(DRAM_DQ03//DQL3_A) U?#5.C8(DQ3)
DDR3_DQ4: U?#4.AA24(DRAM_DQ04//DQL4_A) U?#5.E3(NF,_DQ4)
DDR3_DQ5: U?#4.Y25(DRAM_DQ05//DQL5_A) U?#5.E8(NF,_DQ5)
DDR3_DQ6: U?#4.AA25(DRAM_DQ06//DQL6_A) U?#5.D2(NF,_DQ6)
DDR3_DQ7: U?#4.AB25(DRAM_DQ07//DQL7_A) U?#5.E7(NF,_DQ7)
DDR3_DQ8: U?#4.AB22(DRAM_DQ08//DQU0_A) U?#6.B3(DQ0)
DDR3_DQ9: U?#4.AA22(DRAM_DQ09//DQU1_A) U?#6.C7(DQ1)
DDR3_DQ10: U?#4.AA23(DRAM_DQ10//DQU2_A) U?#6.C2(DQ2)
DDR3_DQ11: U?#4.AA20(DRAM_DQ11//DQU3_A) U?#6.C8(DQ3)
DDR3_DQ12: U?#4.AA18(DRAM_DQ12//DQU4_A) U?#6.E3(NF,_DQ4)
DDR3_DQ13: U?#4.AB19(DRAM_DQ13//DQU5_A) U?#6.E8(NF,_DQ5)
DDR3_DQ14: U?#4.AA19(DRAM_DQ14//DQU6_A) U?#6.D2(NF,_DQ6)
DDR3_DQ15: U?#4.AA17(DRAM_DQ15//DQU7_A) U?#6.E7(NF,_DQ7)
DDR3_DQS0_N: U?#4.AC25(DRAM_DQS0_N//DQSL#_A) U?#5.D3(DQS#)
DDR3_DQS0_P: U?#4.AC24(DRAM_DQS0_P//DQSL_A) U?#5.C3(DQS)
DDR3_DQS1_N: U?#4.AC21(DRAM_DQS1_N//DQSU#_A) U?#6.D3(DQS#)
DDR3_DQS1_P: U?#4.AB21(DRAM_DQS1_P//DQSU_A) U?#6.C3(DQS)
DDR3_ODT0: U?#4.AC12(DRAM_AC36//ODT0) U?#5.G1(ODT0) U?#6.G1(ODT0)
DDR3_ODT1: U?#4.AE11(DRAM_AC37//ODT1) U?#5.F1(ODT1) U?#6.F1(ODT1)
DDR3_RAS#: U?#4.AB10(DRAM_AC35//RAS#) U?#5.F3(RAS#) U?#6.F3(RAS#)
DDR3_RESET#: U?#4.AB13(DRAM_RESET_N//RESET#) U?#5.N2(RESET#) U?#6.N2(RESET#)
DDR3_WE#: U?#4.AC10(DRAM_AC34//WE#) U?#5.H3(WE#) U?#6.H3(WE#)

Not connected (* = marked no-connect by the designer): U?#4 AA1(DRAM_DQ22//DQL6_B) AA2(DRAM_DQ20//DQL4_B) AA3(DRAM_DQ26//DQU2_B) AA4(DRAM_DQ25//DQU1_B) AA6(DRAM_DQ27//DQU3_B) AA7(DRAM_DQ30//DQU6_B) AA8(DRAM_DQ28//DQU4_B) AA9(DRAM_DQ31//DQU7_B) AA12(DRAM_AC27//—) AA13(DRAM_ZN//ZQ) AA14(DRAM_VREF//VREF) AB1(DRAM_DQ23//DQL7_B) AB4(DRAM_DQ24//DQU0_B) AB5(DRAM_DQS3_P//DQSU_B) AB6(DRAM_DM3//DMU_B) AB7(DRAM_DQ29//DQU5_B) AB14(DRAM_AC19//MTEST) AB20(DRAM_DM1//DMU_A) AC1(DRAM_DQS2_N//DQSL#_B) AC2(DRAM_DQS2_P//DQSL_B) AC5(DRAM_DQS3_N//DQSU#_B) AC9(DRAM_AC23//—) AC13(DRAM_ALERT_N//MTEST1) AC18(DRAM_AC03//—) AD2(DRAM_DQ17//DQL1_B) AD3(DRAM_DM2//DML_B) AD4(DRAM_DQ19//DQL3_B) AD8(DRAM_AC22//—) AD10(DRAM_AC20//CK_B) AD23(DRAM_DM0//DML_A) AE3(DRAM_DQ16//DQL0_B) AE4(DRAM_DQ18//DQL2_B) AE8(DRAM_AC32//—) AE10(DRAM_AC21//CK#_B) Y1(DRAM_DQ21//DQL5_B); U?#5 A1(VSS) A2(VDD) A3(NC) A7(NF,_NF/TDQS#)* A8(VSS) A9(VDD) B1(VSS) B2(VSSQ) B7(DM,_DM/TDQS) B8(VSSQ) B9(VDDQ) C1(VDDQ) C9(VSSQ) D1(VSSQ) D7(VDD) D8(VSS) D9(VSSQ) E1(VREFDQ) E2(VDDQ) E9(VDDQ) F2(VSS) F8(VSS) G2(VDD) G8(VDD) H8(ZQ0) H9(ZQ1) J1(VSS) J8(VREFCA) J9(VSS) K1(VDD) K9(VDD) L1(VSS) L9(VSS) M1(VDD) M9(VDD) N1(VSS) N9(VSS); U?#6 A1(VSS) A2(VDD) A3(NC) A7(NF,_NF/TDQS#)* A8(VSS) A9(VDD) B1(VSS) B2(VSSQ) B7(DM,_DM/TDQS) B8(VSSQ) B9(VDDQ) C1(VDDQ) C9(VSSQ) D1(VSSQ) D7(VDD) D8(VSS) D9(VSSQ) E1(VREFDQ) E2(VDDQ) E9(VDDQ) F2(VSS) F8(VSS) G2(VDD) G8(VDD) H8(ZQ0) H9(ZQ1) J1(VSS) J8(VREFCA) J9(VSS) K1(VDD) K9(VDD) L1(VSS) L9(VSS) M1(VDD) M9(VDD) N1(VSS) N9(VSS)